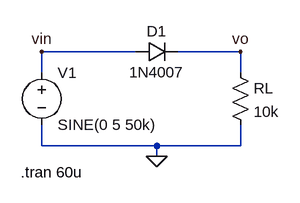
[diagram p0: schematic RECTIFICADOR_de_ONDA.asc]
RECTIFICADOR_de_ONDA.asc, the LTspice schematic file:
Version 4
SHEET 1 880 680
WIRE 128 64 -16 64
WIRE 288 64 192 64
WIRE -16 96 -16 64
WIRE 288 96 288 64
WIRE -16 208 -16 176
WIRE 160 208 -16 208
WIRE 288 208 288 176
WIRE 288 208 160 208
WIRE 160 224 160 208
FLAG 160 224 0
FLAG 288 64 vo
FLAG -16 64 vin
SYMBOL diode 128 80 R270
WINDOW 0 32 32 VTop 2
WINDOW 3 0 32 VBottom 2
SYMATTR InstName D1
SYMATTR Value 1N4007
SYMBOL res 272 80 R0
SYMATTR InstName RL
SYMATTR Value 10k
SYMBOL voltage -16 80 R0
WINDOW 123 0 0 Left 0
WINDOW 39 0 0 Left 0
SYMATTR InstName V1
SYMATTR Value SINE(0 5 50k)
TEXT -48 248 Left 2 !.tran 60u

The netlist it stands for:
* RECTIFICADOR_de_ONDA.asc
D1 vin vo 1N4007
RL vo 0 10k
V1 vin 0 SINE(0 5 50k)
.model D D
.lib standard.dio
.tran 60u
.backanno
.end

* Results of the author's LTspice run, read from the files saved beside the schematic
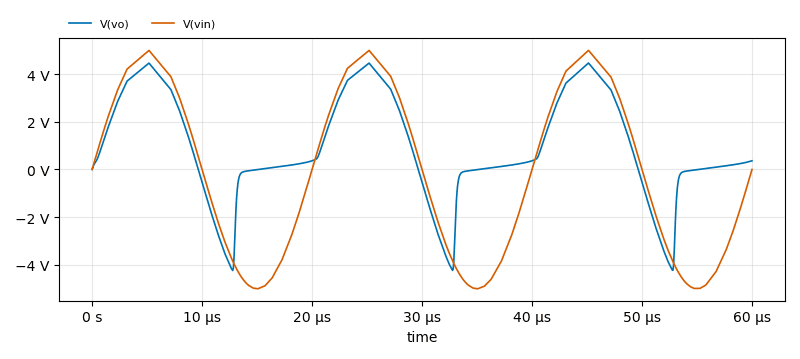
[diagram p1: Transient Analysis of RECTIFICADOR_de_ONDA.asc, plotted from the saved traces]
* Transient Analysis, 1 run:
*   V(vo): min -4.233 V, max 4.46 V, average 933.8 mV, rms 2.408 V, last 364 mV
*   V(vin): min -4.999 V, max 4.991 V, average -29.57 mV, rms 3.501 V, last 0 V